# Altium schematic sheet BOOTSTRAP.SchDoc
size A4; DocumentNumber: 5; SheetNumber: 5; SheetTotal: 12
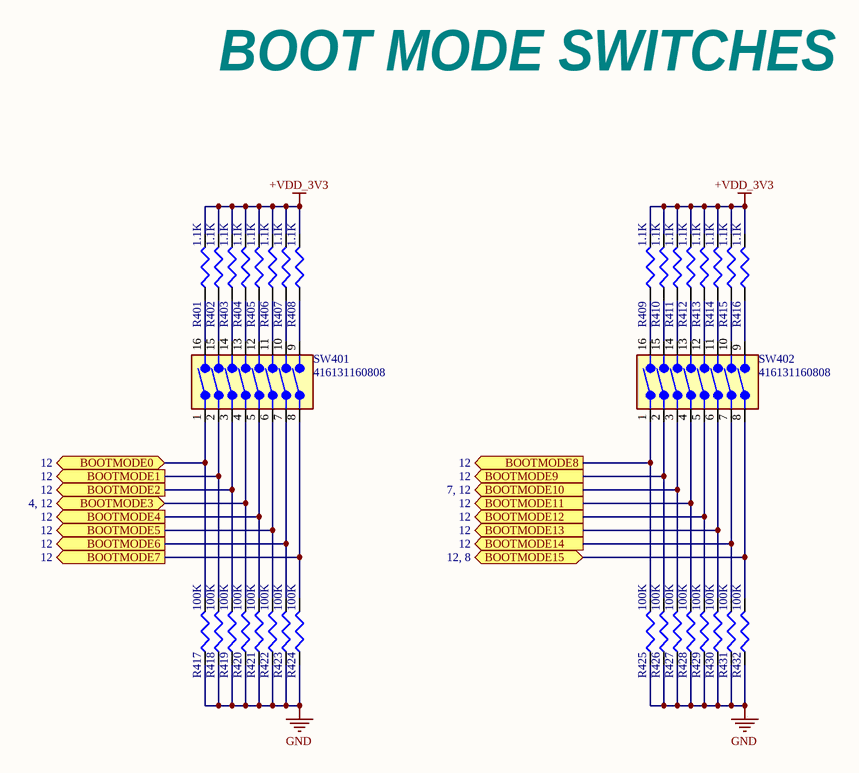
[diagram p0: BOOTSTRAP.SchDoc]

## Parts
R401  1.1K  [R0201]
R402  1.1K  [R0201]
R403  1.1K  [R0201]
R404  1.1K  [R0201]
R405  1.1K  [R0201]
R406  1.1K  [R0201]
R407  1.1K  [R0201]
R408  1.1K  [R0201]
R409  1.1K  [R0201]
R410  1.1K  [R0201]
R411  1.1K  [R0201]
R412  1.1K  [R0201]
R413  1.1K  [R0201]
R414  1.1K  [R0201]
R415  1.1K  [R0201]
R416  1.1K  [R0201]
R417  100K  [R0201]
R418  100K  [R0201]
R419  100K  [R0201]
R420  100K  [R0201]
R421  100K  [R0201]
R422  100K  [R0201]
R423  100K  [R0201]
R424  100K  [R0201]
R425  100K  [R0201]
R426  100K  [R0201]
R427  100K  [R0201]
R428  100K  [R0201]
R429  100K  [R0201]
R430  100K  [R0201]
R431  100K  [R0201]
R432  100K  [R0201]
SW401  416131160808  [SW_416131160808]
SW402  416131160808  [SW_416131160808]

## Ports
BOOTMODE0 (bidir, see 12), BOOTMODE1 (out, see 12), BOOTMODE2 (out, see 12), BOOTMODE3 (bidir, see 4, 12), BOOTMODE4 (out, see 12), BOOTMODE5 (out, see 12), BOOTMODE6 (out, see 12), BOOTMODE7 (out, see 12), BOOTMODE8 (out, see 12), BOOTMODE9 (out, see 12), BOOTMODE10 (out, see 7, 12), BOOTMODE11 (out, see 12), BOOTMODE12 (out, see 12), BOOTMODE13 (out, see 12), BOOTMODE14 (out, see 12), BOOTMODE15 (bidir, see 12, 8)

## Nets
+VDD_3V3: R401.2 R402.2 R403.2 R404.2 R405.2 R406.2 R407.2 R408.2 R409.2 R410.2 R411.2 R412.2 R413.2 R414.2 R415.2 R416.2
GND: R417.1 R418.1 R419.1 R420.1 R421.1 R422.1 R423.1 R424.1 R425.1 R426.1 R427.1 R428.1 R429.1 R430.1 R431.1 R432.1
BOOTMODE0: R417.2 SW401.1 ; port BOOTMODE0
BOOTMODE1: R418.2 SW401.2 ; port BOOTMODE1
BOOTMODE2: R419.2 SW401.3 ; port BOOTMODE2
BOOTMODE3: R420.2 SW401.4 ; port BOOTMODE3
BOOTMODE4: R421.2 SW401.5 ; port BOOTMODE4
BOOTMODE5: R422.2 SW401.6 ; port BOOTMODE5
BOOTMODE6: R423.2 SW401.7 ; port BOOTMODE6
BOOTMODE7: R424.2 SW401.8 ; port BOOTMODE7
BOOTMODE8: R425.2 SW402.1 ; port BOOTMODE8
BOOTMODE9: R426.2 SW402.2 ; port BOOTMODE9
BOOTMODE10: R427.2 SW402.3 ; port BOOTMODE10
BOOTMODE11: R428.2 SW402.4 ; port BOOTMODE11
BOOTMODE12: R429.2 SW402.5 ; port BOOTMODE12
BOOTMODE13: R430.2 SW402.6 ; port BOOTMODE13
BOOTMODE14: R431.2 SW402.7 ; port BOOTMODE14
BOOTMODE15: R432.2 SW402.8 ; port BOOTMODE15
NetR401_1: R401.1 SW401.16
NetR402_1: R402.1 SW401.15
NetR403_1: R403.1 SW401.14
NetR404_1: R404.1 SW401.13
NetR405_1: R405.1 SW401.12
NetR406_1: R406.1 SW401.11
NetR407_1: R407.1 SW401.10
NetR408_1: R408.1 SW401.9
NetR409_1: R409.1 SW402.16
NetR410_1: R410.1 SW402.15
NetR411_1: R411.1 SW402.14
NetR412_1: R412.1 SW402.13
NetR413_1: R413.1 SW402.12
NetR414_1: R414.1 SW402.11
NetR415_1: R415.1 SW402.10
NetR416_1: R416.1 SW402.9

## Notes on the sheet
- BOOT MODE SWITCHES

## Library data of the parts
R401-R416 = RC0201FR-071K1L: SMD Chip Resistor, 1.1 kOhm, ± 1%, 50 mW, 0201 [0603 Metric], Thick Film, General Purpose; Manufacturer: Yageo; Voltage Rating: 25V; Supplier 1: Arrow Electronics; Manufacturer Part Number: RC0201FR-071K1L; RoHS: Yes; Category: Chip SMD Resistors; Stock 1: 20000; Pricing 1: 10000=0.0017, 20000=0.0016, 50000=0.0011 (USD); ComponentLink1URL: https://datasheet.octopart.com/RC0201FR-071K1L-Yageo-datasheet-164759695.pdf?src-supplier=Future+Electronics; ComponentLink1Description: https://datasheet.octopart.com/RC0201FR-071K1L-Yageo-datasheet-164759695.pdf?src-supplier=Future+Electronics; ComponentLink2URL: http://www.yageo.com/documents/recent/PYu-RC0201_51_RoHS_L_(8).pdf?src-supplier=Future+Electronics; ComponentLink2Description: http://www.yageo.com/documents/recent/PYu-RC0201_51_RoHS_L_(8).pdf?src-supplier=Future+Electronics; ComponentLink3URL: https://www.yageo.com/upload/media/product/productsearch/datasheet/rchip/PYu-RC_Group_51_RoHS_L_11.pdf?src-supplier=Digi-Key; ComponentLink3Description: https://www.yageo.com/upload/media/product/productsearch/datasheet/rchip/PYu-RC_Group_51_RoHS_L_11.pdf?src-supplier=Digi-Key; ComponentLink4URL: http://www.yageo.com/documents/recent/PYu-RC_Group_51_RoHS_L_9.pdf?src-supplier=Digi-Key; ComponentLink4Description: http://www.yageo.com/documents/recent/PYu-RC_Group_51_RoHS_L_9.pdf?src-supplier=Digi-Key; ComponentLink5URL: http://www.yageo.com.tw/exep/pages/download/literatures/PYu-R_INT-thick_7.pdf?src-supplier=Digi-Key; ComponentLink5Description: http://www.yageo.com.tw/exep/pages/download/literatures/PYu-R_INT-thick_7.pdf?src-supplier=Digi-Key; Supplier Part Number 1: RC0201FR-071K1L
R417-R432 = RC0201FR-07100KL: SMD Chip Resistor, 100 kOhm, ± 1%, 50 mW, 0201 [0603 Metric], Thick Film, General Purpose; Manufacturer: Yageo; Voltage Rating (DC): 25V; Supplier 1: Future Electronics; Manufacturer Part Number: RC0201FR-07100KL; RoHS: Yes; Category: Chip SMD Resistors; Stock 1: 5090000; Pricing 1: 10000=0.0006, 100000=0.0006, 300000=0.0006, 750000=0.0005, 2000000=0.0005 (USD); Number of Pins: 2NUMBER; Lead Free: 5697LeadFree; ComponentLink1URL: https://datasheet.ciiva.com/2493/pyu-r-int-thick-7-2493769.pdf?src-supplier=Digi-Key; ComponentLink1Description: https://datasheet.ciiva.com/2493/pyu-r-int-thick-7-2493769.pdf?src-supplier=Digi-Key; ComponentLink2URL: https://datasheet.ciiva.com/2493/pyu-r-int-thick-7-2493770.pdf?src-supplier=Digi-Key; ComponentLink2Description: https://datasheet.ciiva.com/2493/pyu-r-int-thick-7-2493770.pdf?src-supplier=Digi-Key; ComponentLink3URL: https://datasheet.ciiva.com/2493/pyu-r-int-thick-7-2493771.pdf?src-supplier=Digi-Key; ComponentLink3Description: https://datasheet.ciiva.com/2493/pyu-r-int-thick-7-2493771.pdf?src-supplier=Digi-Key; ComponentLink4URL: https://datasheet.ciiva.com/26829/getdatasheetpartid-420441-26829850.pdf?src-supplier=Verical; ComponentLink4Description: https://datasheet.ciiva.com/26829/getdatasheetpartid-420441-26829850.pdf?src-supplier=Verical; ComponentLink5URL: https://datasheet.ciiva.com/22698/1563626-22698495.pdf?src-supplier=Element14; ComponentLink5Description: https://datasheet.ciiva.com/22698/1563626-22698495.pdf?src-supplier=Element14; ComponentLink6URL: https://datasheet.ciiva.com/7660/1421516-7660806.pdf?src-supplier=Element14; ComponentLink6Description: https://datasheet.ciiva.com/7660/1421516-7660806.pdf?src-supplier=Element14; ComponentLink7URL: https://datasheet.ciiva.com/46391/1421516-46391338.pdf?src-supplier=Element14; ComponentLink7Description: https://datasheet.ciiva.com/46391/1421516-46391338.pdf?src-supplier=Element14; Supplier Part Number 1: 6247191
SW401 SW402 = 416131160808: Slide Dip Switch, 8 Switches, 8PST, Latched, 0.025A, 24VDC, Solder Terminal, Surface Mount-straight; Manufacturer: Wurth Electronics; Supplier 1: Digi-Key; Manufacturer Part Number: 416131160808; RoHS: Yes; Category: DIP Switches; Stock 1: 11089; Pricing 1: 1=6.8, 10=6.579, 50=6.233, 100=5.54, 500=5.19402 (USD); ComponentLink1URL: https://datasheet.ciiva.com/2863/4161311608xx-2863767.pdf?src-supplier=Digi-Key; ComponentLink1Description: https://datasheet.ciiva.com/2863/4161311608xx-2863767.pdf?src-supplier=Digi-Key; ComponentLink2URL: https://datasheet.ciiva.com/2863/4161311608xx-2863768.pdf?src-supplier=Digi-Key; ComponentLink2Description: https://datasheet.ciiva.com/2863/4161311608xx-2863768.pdf?src-supplier=Digi-Key; ComponentLink3URL: https://datasheet.ciiva.com/1528/4161311608xx-1528930.pdf?src-supplier=Element14; ComponentLink3Description: https://datasheet.ciiva.com/1528/4161311608xx-1528930.pdf?src-supplier=Element14; ComponentLink4URL: https://datasheet.ciiva.com/1625/4161311608xx-1625347.pdf?src-supplier=Farnell; ComponentLink4Description: https://datasheet.ciiva.com/1625/4161311608xx-1625347.pdf?src-supplier=Farnell; Supplier Part Number 1: 732-416131160808CT-ND